# Altium schematic sheet P08_eMMC FLASH.SchDoc
size 386 x 246 mm
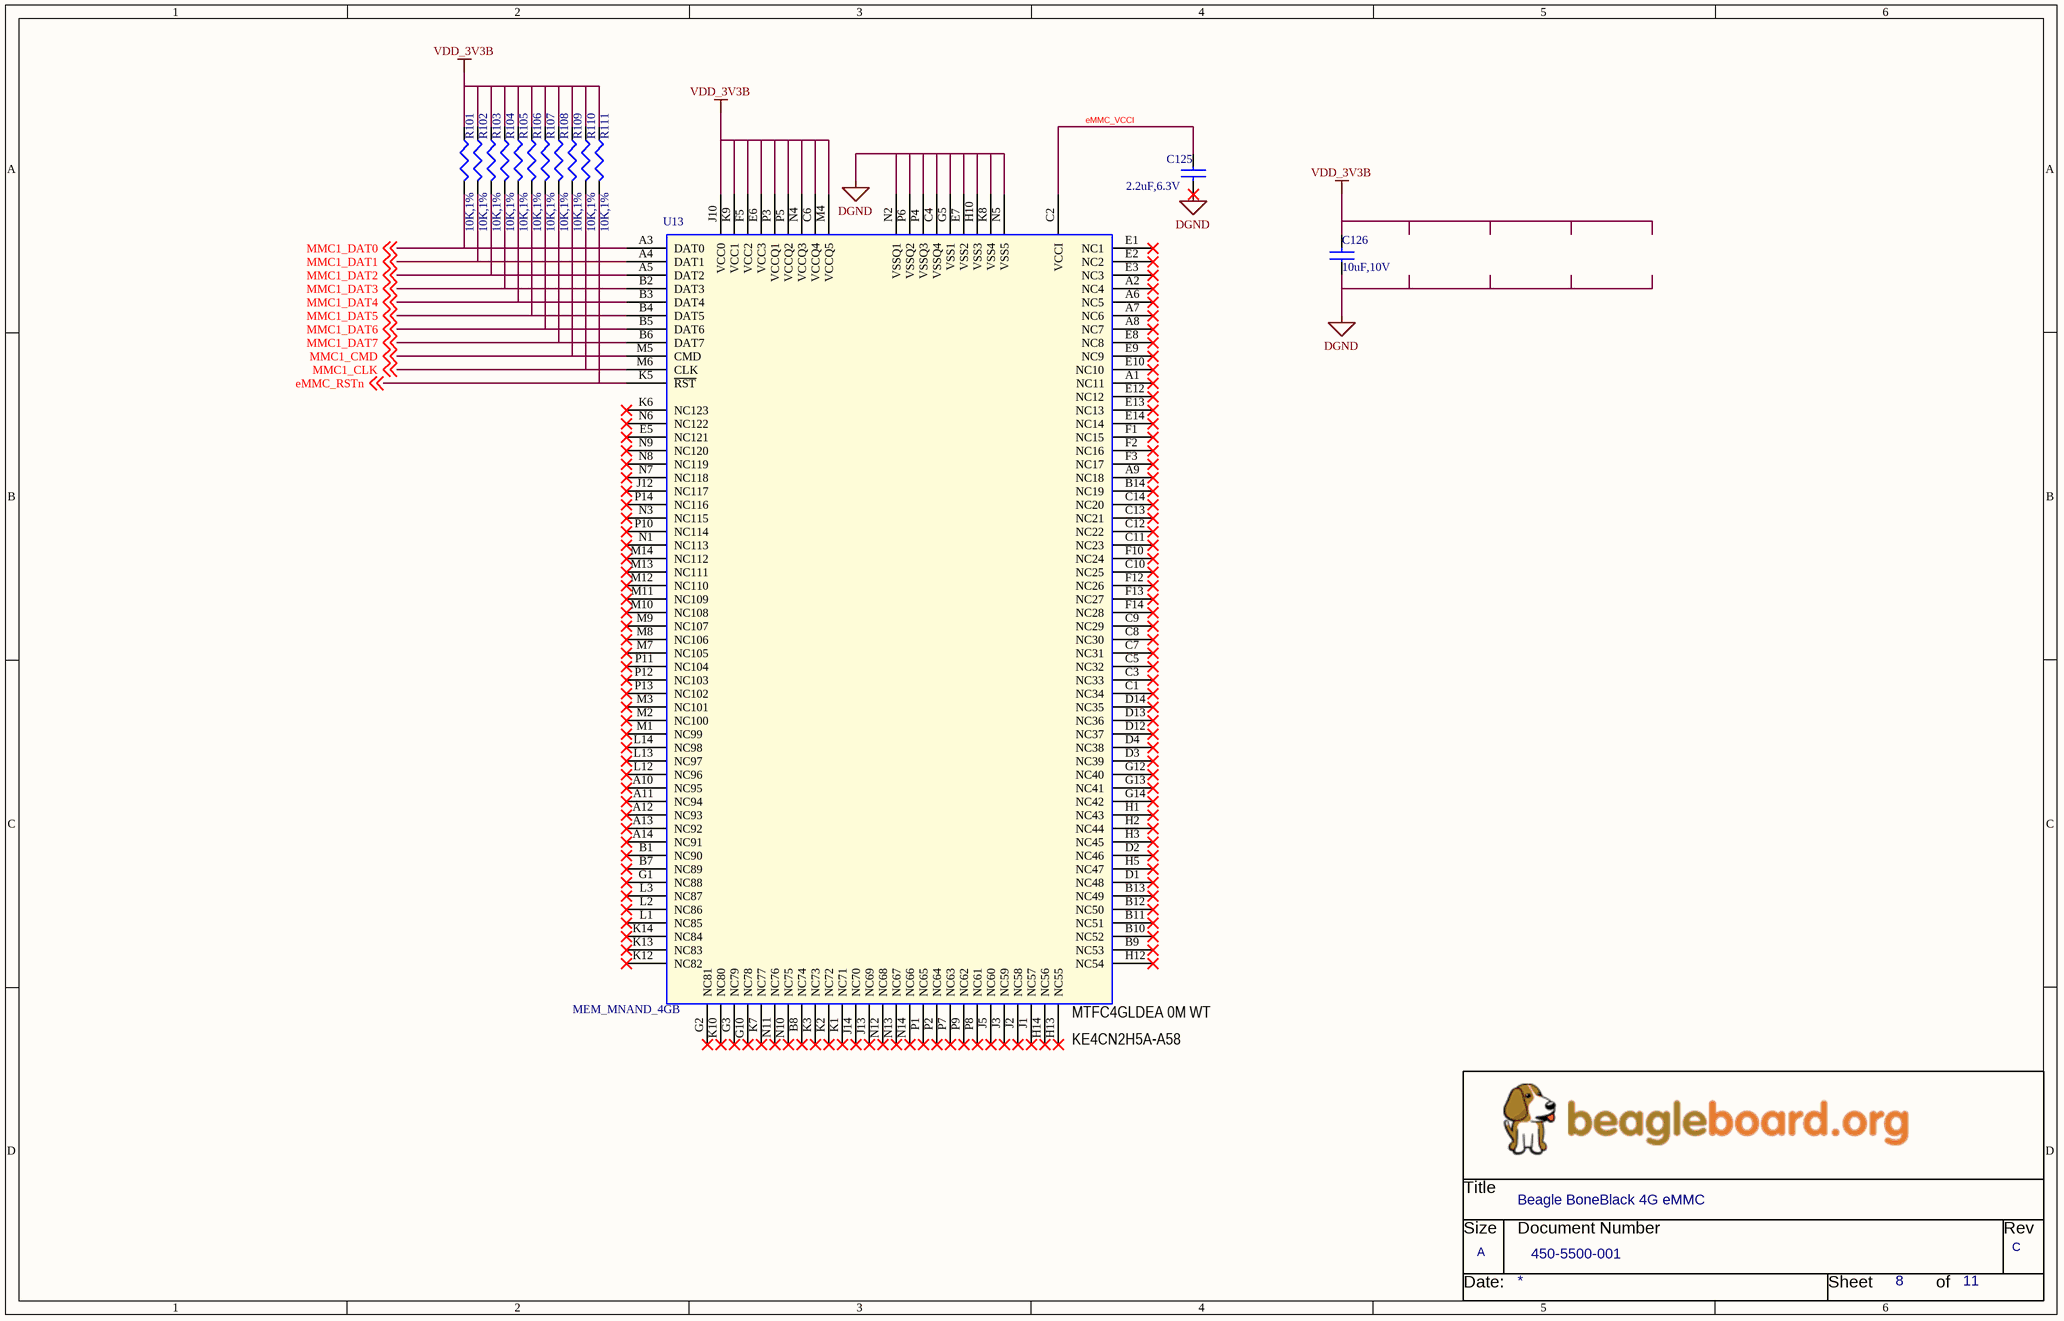
[diagram p0: P08_eMMC FLASH.SchDoc]

## Parts
*  Page Count: 11  Page Number: 8  Page Size: A  Title: Beagle BoneBlack 4G eMMC  RevCode: C  Doc: 450-5500-001  (hidden comment: BeagleBoard_org)  (graphical)
C125  2.2uF,6.3V  [402]
C126  10uF,10V  [r402-25rd]
R101  10K,1%  [402]
R102  10K,1%  [402]
R103  10K,1%  [402]
R104  10K,1%  [402]
R105  10K,1%  [402]
R106  10K,1%  [402]
R107  10K,1%  [402]
R108  10K,1%  [402]
R109  10K,1%  [402]
R110  10K,1%  [402]
R111  10K,1%  [402]
U13  MEM_MNAND_4GB  [BGA153_P14_P5_11P5X13]

## Nets
DGND: C125.2 C126.1 U13.C4(VSSQ4) U13.E7(VSS2) U13.G5(VSS1) U13.H10(VSS3) U13.K8(VSS4) U13.N2(VSSQ1) U13.N5(VSS5) U13.P4(VSSQ3) U13.P6(VSSQ2)
VDD_3V3B: C126.2 R101.1 R102.1 R103.1 R104.1 R105.1 R106.1 R107.1 R108.1 R109.1 R110.1 R111.1 U13.C6(VCCQ4) U13.E6(VCC3) U13.F5(VCC2) U13.J10(VCC0) U13.K9(VCC1) U13.M4(VCCQ5) U13.N4(VCCQ3) U13.P3(VCCQ1) U13.P5(VCCQ2)
eMMC_RSTn: R111.2 U13.K5(~{RST}) ; off-sheet eMMC_RSTn
eMMC_VCCI: C125.1 U13.C2(VCCI)
MMC1_CLK: R110.2 U13.M6(CLK) ; off-sheet MMC1_CLK
MMC1_CMD: R109.2 U13.M5(CMD) ; off-sheet MMC1_CMD
MMC1_DAT0: R101.2 U13.A3(DAT0) ; off-sheet MMC1_DAT0
MMC1_DAT1: R102.2 U13.A4(DAT1) ; off-sheet MMC1_DAT1
MMC1_DAT2: R103.2 U13.A5(DAT2) ; off-sheet MMC1_DAT2
MMC1_DAT3: R104.2 U13.B2(DAT3) ; off-sheet MMC1_DAT3
MMC1_DAT4: R105.2 U13.B3(DAT4) ; off-sheet MMC1_DAT4
MMC1_DAT5: R106.2 U13.B4(DAT5) ; off-sheet MMC1_DAT5
MMC1_DAT6: R107.2 U13.B5(DAT6) ; off-sheet MMC1_DAT6
MMC1_DAT7: R108.2 U13.B6(DAT7) ; off-sheet MMC1_DAT7

Not connected (* = marked no-connect by the designer): U13 A1(NC11)* A2(NC4)* A6(NC5)* A7(NC6)* A8(NC7)* A9(NC18)* A10(NC95)* A11(NC94)* A12(NC93)* A13(NC92)* A14(NC91)* B1(NC90)* B7(NC89)* B8(NC74)* B9(NC53)* B10(NC52)* B11(NC51)* B12(NC50)* B13(NC49)* B14(NC19)* C1(NC34)* C3(NC33)* C5(NC32)* C7(NC31)* C8(NC30)* C9(NC29)* C10(NC25)* C11(NC23)* C12(NC22)* C13(NC21)* C14(NC20)* D1(NC48)* D2(NC46)* D3(NC39)* D4(NC38)* D12(NC37)* D13(NC36)* D14(NC35)* E1(NC1)* E2(NC2)* E3(NC3)* E5(NC121)* E8(NC8)* E9(NC9)* E10(NC10)* E12(NC12)* E13(NC13)* E14(NC14)* F1(NC15)* F2(NC16)* F3(NC17)* F10(NC24)* F12(NC26)* F13(NC27)* F14(NC28)* G1(NC88)* G2(NC81)* G3(NC79)* G10(NC78)* G12(NC40)* G13(NC41)* G14(NC42)* H1(NC43)* H2(NC44)* H3(NC45)* H5(NC47)* H12(NC54)* H13(NC55)* H14(NC56)* J1(NC57)* J2(NC58)* J3(NC59)* J5(NC60)* J12(NC117)* J13(NC69)* J14(NC70)* K1(NC71)* K2(NC72)* K3(NC73)* K6(NC123)* K7(NC77)* K10(NC80)* K12(NC82)* K13(NC83)* K14(NC84)* L1(NC85)* L2(NC86)* L3(NC87)* L12(NC96)* L13(NC97)* L14(NC98)* M1(NC99)* M2(NC100)* M3(NC101)* M7(NC105)* M8(NC106)* M9(NC107)* M10(NC108)* M11(NC109)* M12(NC110)* M13(NC111)* M14(NC112)* N1(NC113)* N3(NC115)* N6(NC122)* N7(NC118)* N8(NC119)* N9(NC120)* N10(NC75)* N11(NC76)* N12(NC68)* N13(NC67)* N14(NC66)* P1(NC65)* P2(NC64)* P7(NC63)* P8(NC61)* P9(NC62)* P10(NC114)* P11(NC104)* P12(NC103)* P13(NC102)* P14(NC116)*

## Notes on the sheet
- (near U13) MTFC4GLDEA 0M WT
- (near U13) KE4CN2H5A-A58
- (in symbol BeagleBoard_org) Title; Size; Document Number; Rev; Date:; Sheet; of

## Library data of the parts
C125 = CAP_2.2uF_X5R_6.3V_10%_0402: Desc: CAP, CER, X7R, 0402, 50V, 10%, 0.1uF; Part Number: CAP_2.2uF_X5R_6.3V_10%_0402; PCB Footprint: 402
C126 = CAP_10uF_Y5V_10V_10%_0805: Desc: CAP CER 10UF 10V Y5V 0805; PCB Footprint: 805; Part Number: CAP_10uF_Y5V_10V_10%_0805
R101-R111 = RES_10K_1/16W_1%_0402_Dup1: Resistor 10Kohm 1/16W 1% 0402; Part Number: RES_10K_1/16W_1%_0402; PCB Footprint: 402
U13 = MEM_MNAND_2GB: PCB Footprint: BGA153_P14_P5_11P5X13
* = BeagleBoard_org: Page Create Date: March  8, 1995; Page Modify Date: *